# EAGLE design Logic_Level_Bidirectional (EAGLE 7.2.0)
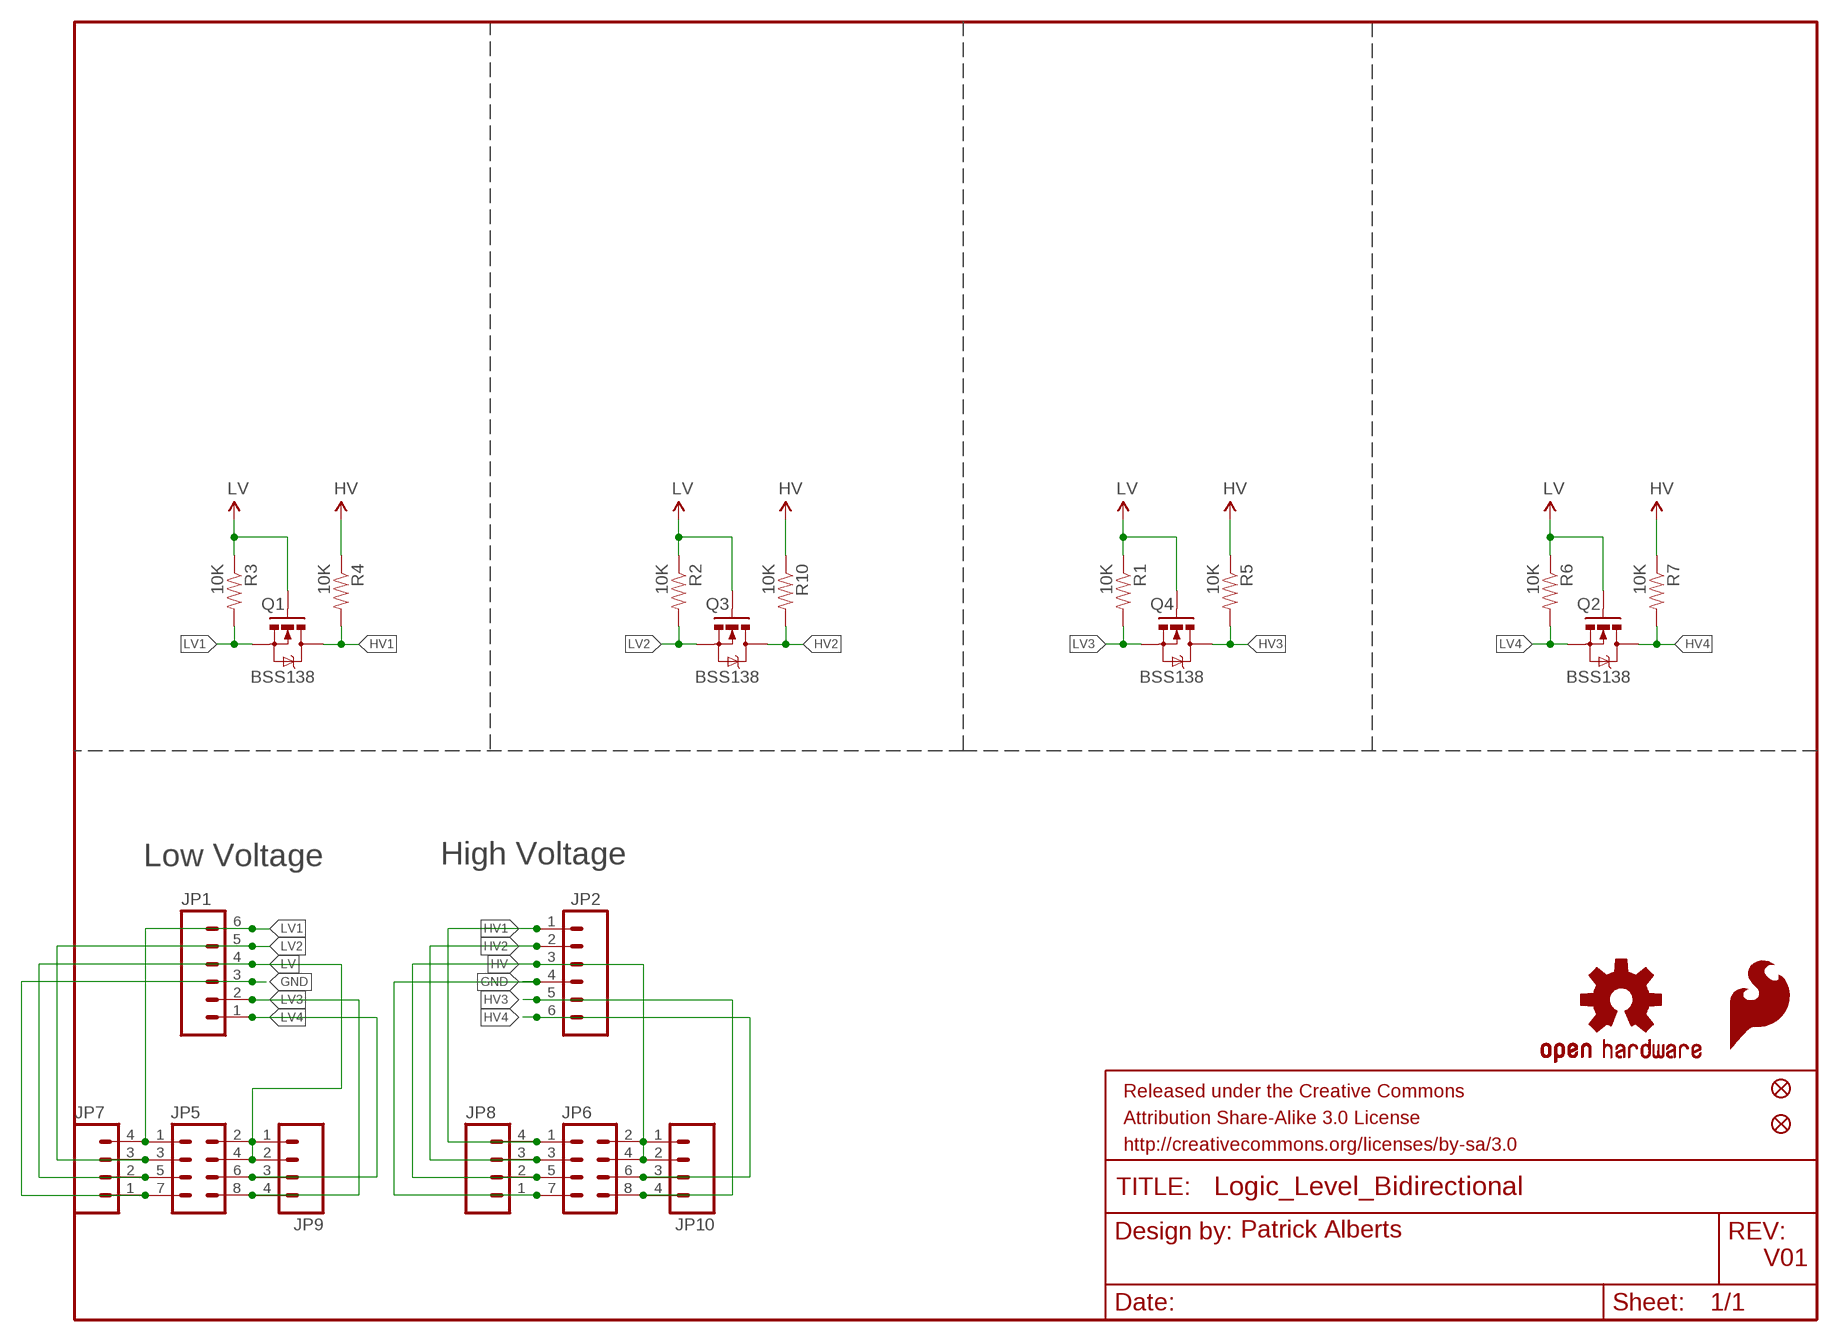
[diagram p0: schematic, sheet 1]

## Parts
JP1  M06SIP  [1X06]
JP2  M06SIP  [1X06]
JP3  FIDUCIALUFIDUCIAL  [MICRO-FIDUCIAL]
JP4  FIDUCIALUFIDUCIAL  [MICRO-FIDUCIAL]
JP5  M04X2  [2X4]
JP6  M04X2  [2X4]
JP7  M04LOCK  [1X04_LOCK]
JP8  M04LOCK  [1X04_LOCK]
JP9  M04PTH  [1X04]
JP10  M04PTH  [1X04]
LOGO1  SFE_LOGO_FLAME.1_INCH  [SFE_LOGO_FLAME_.1]
LOGO2  OSHW-LOGOS  [OSHW-LOGO-S]
Q1  BSS138  MOSFET-NCHANNELSMD  [SOT23-3]
Q2  BSS138  MOSFET-NCHANNELSMD  [SOT23-3]
Q3  BSS138  MOSFET-NCHANNELSMD  [SOT23-3]
Q4  BSS138  MOSFET-NCHANNELSMD  [SOT23-3]
R1  10K  RESISTOR0603-RES  [0603-RES]
R2  10K  RESISTOR0603-RES  [0603-RES]
R3  10K  RESISTOR0603-RES  [0603-RES]
R4  10K  RESISTOR0603-RES  [0603-RES]
R5  10K  RESISTOR0603-RES  [0603-RES]
R6  10K  RESISTOR0603-RES  [0603-RES]
R7  10K  RESISTOR0603-RES  [0603-RES]
R10  10K  RESISTOR0603-RES  [0603-RES]

## Nets
GND: JP1.3 JP2.4 JP5.7 JP6.7 JP7.1 JP8.1
HV: JP2.3 JP6.2 JP6.4 JP6.5 JP8.2 JP10.1 JP10.2 R4.1 R5.1 R7.1 R10.1
HV1: JP2.1 JP6.1 JP8.4 Q1.3(D) R4.2
HV2: JP2.2 JP6.3 JP8.3 Q3.3(D) R10.2
HV3: JP2.5 JP6.8 JP10.4 Q4.3(D) R5.2
HV4: JP2.6 JP6.6 JP10.3 Q2.3(D) R7.2
LV: JP1.4 JP5.2 JP5.4 JP5.5 JP7.2 JP9.1 JP9.2 Q1.1(G) Q2.1(G) Q3.1(G) Q4.1(G) R1.1 R2.1 R3.1 R6.1
LV1: JP1.6 JP5.1 JP7.4 Q1.2(S) R3.2
LV2: JP1.5 JP5.3 JP7.3 Q3.2(S) R2.2
LV3: JP1.2 JP5.8 JP9.4 Q4.2(S) R1.2
LV4: JP1.1 JP5.6 JP9.3 Q2.2(S) R6.2

## Notes on the sheet
- Low Voltage | High Voltage
- Patrick Alberts
- V01

## Library data of the parts
JP1 JP2 = SparkFun:M06: Header 6 Standard 6-pin 0.1" header. Use with straight break away headers (SKU : PRT-00116), right angle break away headers (PRT-00553), swiss pins (PRT-00743), machine pins (PRT-00117), and female headers (PRT-00115). Molex polarized connector foot print use with SKU : PRT-08094 with associated crimp pins and housings. NOTES ON THE VARIANTS LOCK and LOCK_LONGPADS... This footprint was designed to help hold the alignment of a through-hole component (i.e. 6-pin header) while soldering it into place. You may notice that each hole has been shifted either up or down by 0.005 of an inch from it's more standard position (which is a perfectly straight line). This slight alteration caused the pins (the squares in the middle) to touch the edges of the holes. Because they are alternating, it causes a "brace" to hold the component in place. 0.005 has proven to be the perfect amount of "off-center" position when using our standard breakaway headers. Although looks a little odd when you look at the bare footprint, once you have a header in there, the alteration is very hard to notice. Also, if you push a header all the way into place, it is covered up entirely on the bottom side. This idea of altering the position of holes to aid alignment will be further integrated into the Sparkfun Library for other footprints. It can help hold any component with 3 or more connection pins.
JP3 JP4 = SparkFun-Aesthetics:FIDUCIAL: Fiducial Alignment Points Various fiducial points for machine vision alignment.
JP5 JP6 = SparkFun-Connectors:M04X2: .1" header, two rows of four.
JP7-JP10 = SparkFun-Connectors:M04: Header 4 Standard 4-pin 0.1" header. Use with straight break away headers (SKU : PRT-00116), right angle break away headers (PRT-00553), swiss pins (PRT-00743), machine pins (PRT-00117), and female headers (PRT-00115). Molex polarized connector foot print use with SKU : PRT-08231 with associated crimp pins and housings. 1MM SMD Version SKU: PRT-10208
LOGO1 = SparkFun-Aesthetics:SFE_LOGO_FLAME: SFE Logo, flame only This is the SparkFun flame logo. The logo on the schematic will always be the same size; the package variant is the height of the flame. Default layer for the logo on the board is tSilk.
LOGO2 = SparkFun-Aesthetics:OSHW-LOGO: Open Source Hardware Logo This logo indicates the piece of hardware it is found on incorporates a OSHW license and/or adheres to the definition of open source hardware found here: http://freedomdefined.org/OSHW
Q1-Q4 = SparkFun:MOSFET-NCHANNEL
R1-R7 R10 = SparkFun:RESISTOR: Resistor Basic schematic elements and footprints for 0603, 1206, and PTH resistors.

## Board
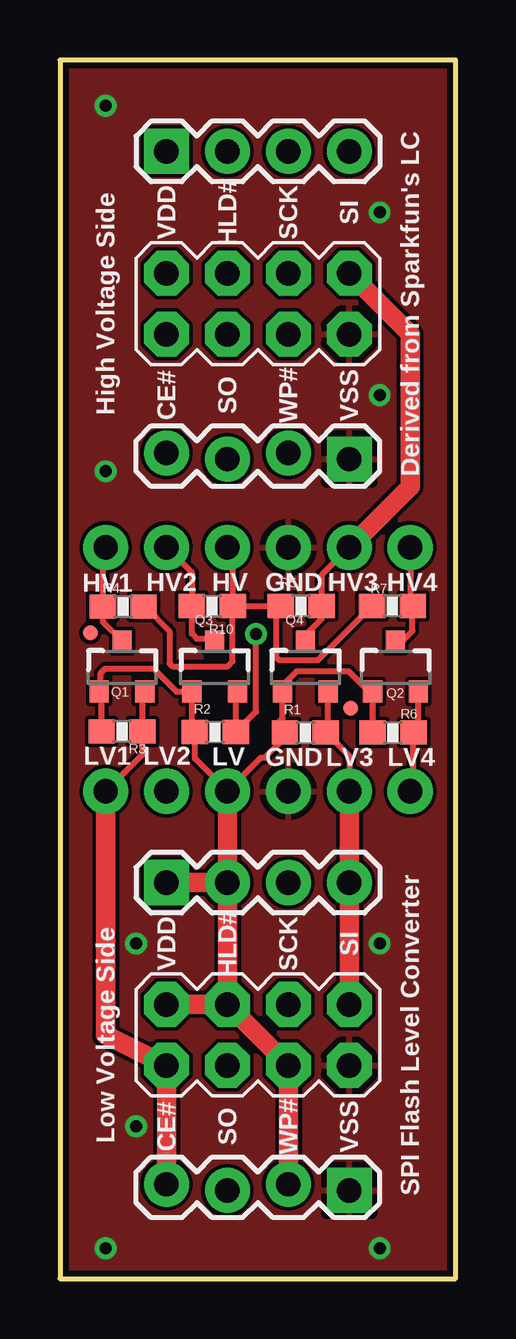
[diagram p1: board, top side]
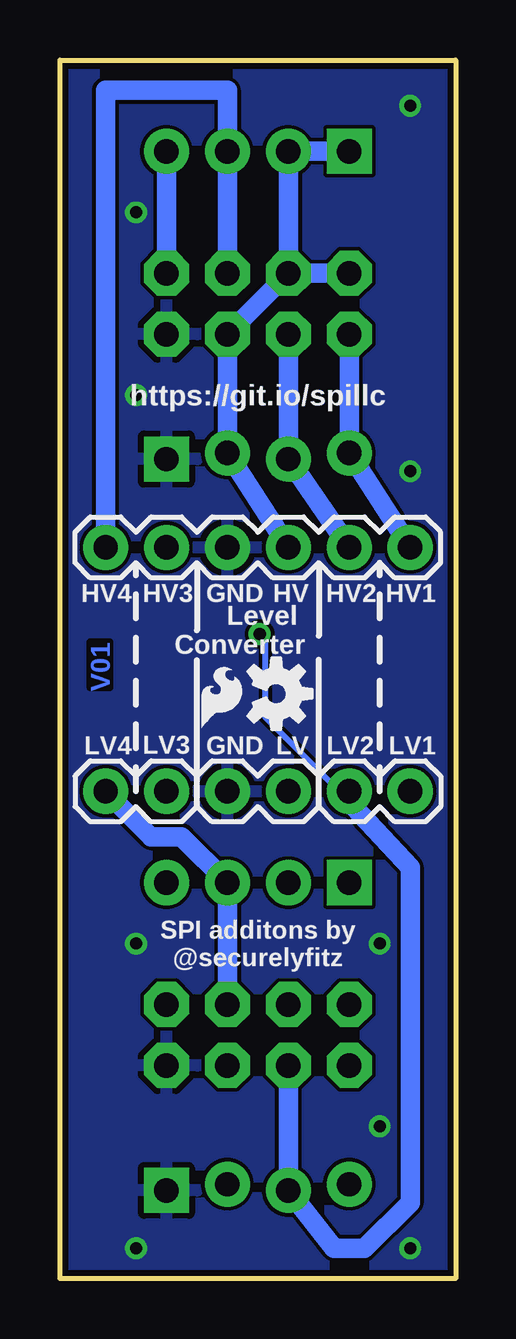
[diagram p2: board, bottom side, seen from below]

Size 16.51 x 50.8 mm. Coordinates in mm from the lower left corner, seen from the top.
Outline: 0,0 16.51,0 16.51,50.8 0,50.8 0,0
Copper layers (1*16): Top 0.035mm / dielectric 1.5mm / Bottom 0.035mm
Design rules "DFRobot_Eagle_Rule_v0.4": minimum track width 6mil, minimum drill 12mil, track to track 6mil, track to pad 6mil, pad to pad 6mil, via to via 6mil, smd to smd 0mil, copper to edge 10mil, drill to drill 10mil, minimum pad ring 12mil, minimum via ring 8mil, stop-mask expansion 2mil, vias tented up to drill 25mil, thermal gap 10mil

### Footprints (pad centres in the part's own frame; a part is rotated, then mirrored left to right if it is on the bottom)
1X06 = drill 1.016 pad 1.88: 1 0,0; 2 2.54,0; 3 5.08,0; 4 7.62,0; 5 10.16,0; 6 12.7,0
MICRO-FIDUCIAL = smd 0.635 x 0.635: 1 0,0
2X4 = drill 1.016 pad 1.88 octagon: 1 -3.81,-1.27; 2 -3.81,1.27; 3 -1.27,-1.27; 4 -1.27,1.27; 5 1.27,-1.27; 6 1.27,1.27; 7 3.81,-1.27; 8 3.81,1.27
1X04_LOCK = drill 1.016 pad 1.88 square: 1 0,0.127 | drill 1.016 pad 1.88: 2 2.54,-0.127; 3 5.08,0.127; 4 7.62,-0.127
1X04 = drill 1.016 pad 1.88 square: 1 0,0 | drill 1.016 pad 1.88: 2 2.54,0; 3 5.08,0; 4 7.62,0
SOT23-3 = smd 0.8 x 0.9: 1 -0.95,-1; 2 0.95,-1; 3 0,1.1
0603-RES = smd 1.1 x 1: 1 -0.85,0; 2 0.85,0

### Placement (x,y rotation side)
JP1  14.61,20.32 0 bottom
JP2  1.91,30.48 180 bottom
JP3  1.27,26.92 0 top
JP4  12.12,23.77 0 top
JP5  8.26,10.16 0 top
JP6  8.26,40.64 0 top
JP7  12.06,3.81 180 top
JP8  12.06,34.29 180 top
JP9  4.45,16.51 0 top
JP10  4.45,46.99 0 top
LOGO1  10.92,22.61 0 bottom
LOGO2  7.49,24.38 270 bottom
Q1  2.59,25.48 0 top
Q2  14,25.48 0 top
Q3  6.45,25.48 0 top
Q4  10.24,25.48 0 top
R1  10.24,22.76 0 top
R2  6.48,22.78 0 top
R3  2.59,22.81 0 top
R4  2.64,28.02 180 top
R5  10.06,28.04 0 top
R6  13.89,22.76 0 top
R7  13.87,28.04 0 top
R10  6.35,28.04 180 top

### Tracks (layer width: path | path; a pad name or v marks a point on that pad's centre or on a via)
GND  (via drill 0.5)
  other vias: 1.91,48.9 1.91,33.66 3.17,13.97 3.17,6.35 1.91,1.27 13.34,1.27 13.34,13.97 13.34,44.45 13.34,36.83
  pour Top: 0,50.8 16.51,50.8 16.51,0 0,0
  pour Bottom: 0,50.8 16.51,50.8 16.51,0 0,0
HV
  Top 0.254: R10.1 R5.1 9.02,27.85 9.02,25.91 9.14,25.78 10.76,25.78 R7.1 | R4.1 3.54,28.02 4.57,26.99 4.57,25.65 4.7,25.53 6.99,25.53 7.2,25.74 R10.1 | JP2.3 7.2,30.27 R10.1
  Bottom 0.813: JP2.3 JP8.2 JP6.5 JP6.4 | JP6.4 JP6.2 | JP6.4 JP10.2 JP10.1
HV1
  Top 0.254: JP2.1 1.79,30.37 R4.2 1.79,27.38 Q1.3
  Bottom 0.813: JP2.1 JP8.4 JP6.1
HV2
  Top 0.254: JP2.2 5.5,29.43 R10.2 5.5,26.89 5.71,26.67 6.36,26.67 Q3.3
  Bottom 0.813: JP2.2 JP8.3 JP6.3
HV3
  Top 0.254: JP2.5 10.91,29.32 R5.2 10.91,27.5 10.24,26.83 Q4.3
  Top 0.813: JP2.5 14.61,33.02 14.61,39.37 JP6.8
  Bottom 0.813: JP10.4 JP6.8
HV4
  Top 0.254: Q2.3 14.28,26.58 14.71,27 14.71,28.03 R7.2 14.61,28.16 JP2.6
  Bottom 0.813: JP6.6 JP10.3 9.53,49.53 14.61,49.53 JP2.6
LV
  Top 0.254: R3.1 1.74,24.38 1.7,24.41 | 1.7,24.41 Q1.1 | 1.7,24.41 1.7,25.25 1.88,25.43 3.91,25.43 4.86,24.48 Q3.1 5.5,22.91 R2.1 5.63,21.68 JP1.4 8.38,21.72 8.56,21.72 9.39,22.54 R1.1 9.03,23.11 9.29,23.37 Q4.1 9.29,24.73 9.88,25.32 12.04,25.32 12.89,24.48 Q2.1 | 12.81,24.48 Q2.1 | R6.1 12.92,22.88 13.04,23.01 Q2.1
  Top 0.813: JP1.4 JP9.2 | JP9.2 JP5.4 | JP5.4 JP5.2 | JP9.1 JP9.2 | JP5.4 JP5.5 JP7.2
LV1
  Top 0.254: Q1.2 3.44,24.38 R3.2 3.44,21.86 JP1.6
  Top 0.813: JP1.6 1.91,10.16 JP5.1 JP7.4
LV2  (via drill 0.51)
  Top 0.254: v8.18,26.87 8.18,23.64 R2.2 7.33,24.4 Q3.2
  Bottom 0.254: JP1.5 4.86,20.32 7.94,23.4 7.94,26.64 v8.18,26.87
  Bottom 0.813: 4.86,20.32 1.91,17.14 1.91,3.17 3.81,1.27 5.08,1.27 JP7.3 JP5.3
LV3
  Top 0.254: JP1.2 12.06,21.78 R1.2 10.93,22.91 11.19,23.17 Q4.2
  Top 0.813: JP1.2 JP9.4 JP5.8
LV4
  Top 0.254: JP1.1 14.74,20.46 R6.2 14.95,22.96 Q2.2
  Bottom 0.813: JP1.1 12.7,18.41 11.43,18.41 JP9.3 JP5.6

### Text on the board
Bottom: V01
tPlace: VDD | HLD# | SCK | SI | High Voltage Side | Derived from Sparkfun's LC | CE# | SO | WP# | VSS | HV1 | HV2 | HV | GND | HV3 | HV4 | LV1 | LV2 | LV | GND | LV3 | LV4 | VDD | HLD# | SCK | SI | Low Voltage Side | SPI Flash Level Converter | CE# | SO | WP# | VSS
bPlace: https://git.io/spillc | HV1 | HV2 | Level / Converter | HV | GND | HV3 | HV4 | LV1 | LV2 | LV | GND | LV3 | LV4 | SPI additons by / @securelyfitz